# EAGLE design SNAC hdmi-mini (EAGLE 7.7.0)
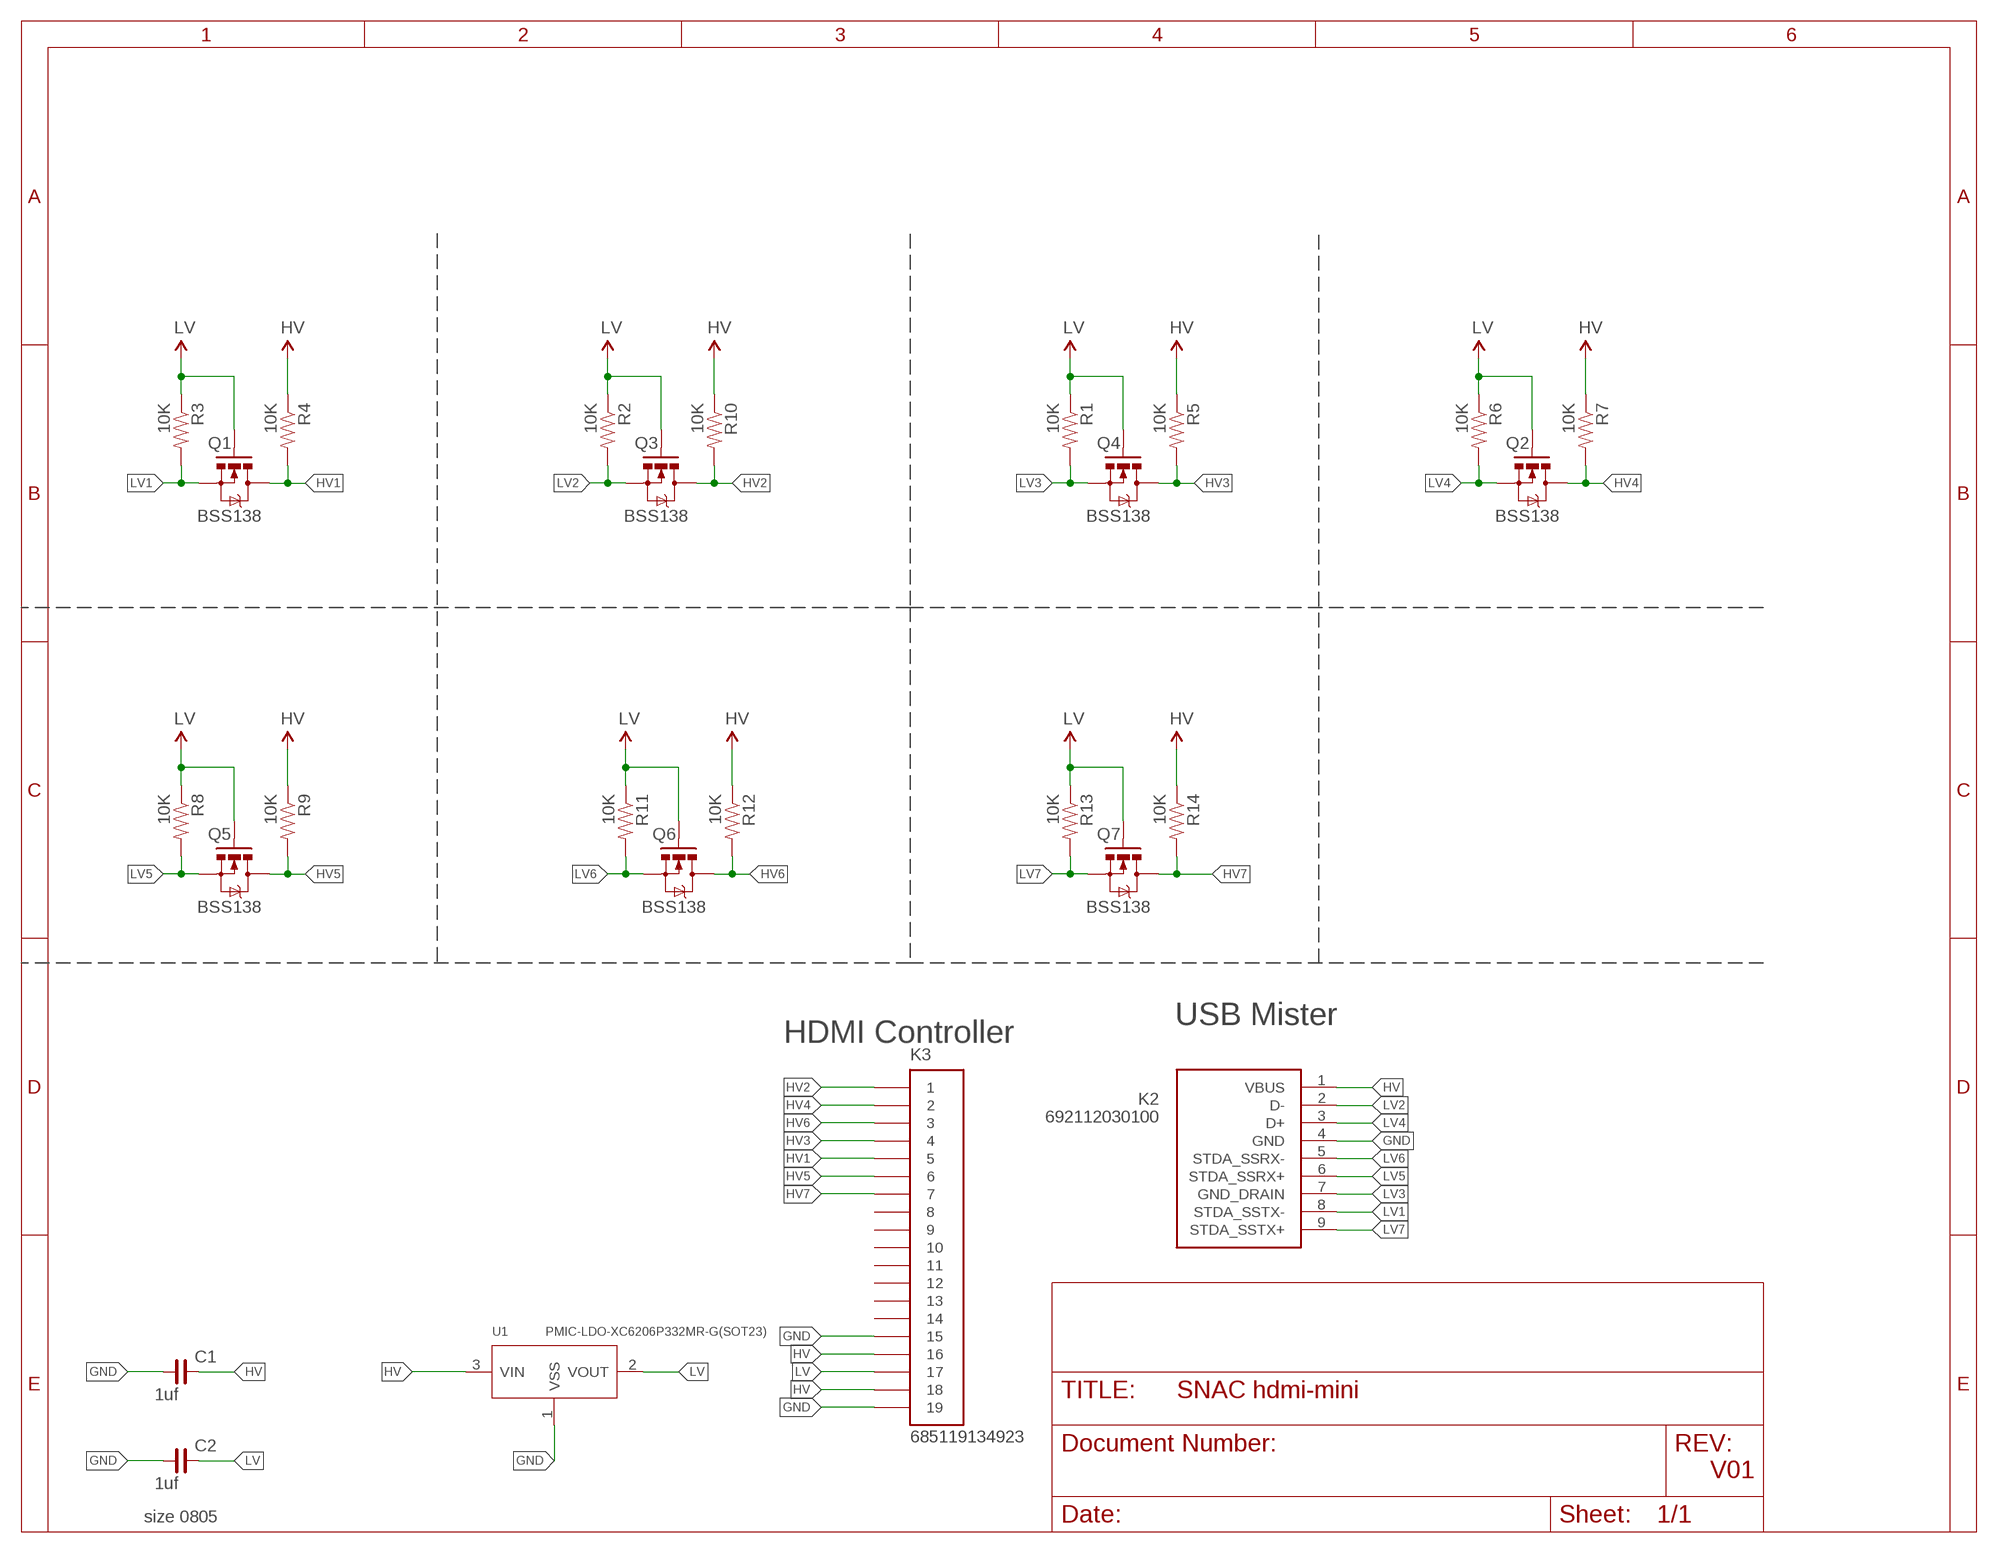
[diagram p0: schematic, sheet 1]

## Parts
C1  1uf  C_0805  [C0805]
C2  1uf  C_0805  [C0805]
K2  692112030100  [692112030100]
K3  685119134923  [685119134923]
Q1  BSS138  MOSFET-NCHANNELSMD  [SOT23-3]
Q2  BSS138  MOSFET-NCHANNELSMD  [SOT23-3]
Q3  BSS138  MOSFET-NCHANNELSMD  [SOT23-3]
Q4  BSS138  MOSFET-NCHANNELSMD  [SOT23-3]
Q5  BSS138  MOSFET-NCHANNELSMD  [SOT23-3]
Q6  BSS138  MOSFET-NCHANNELSMD  [SOT23-3]
Q7  BSS138  MOSFET-NCHANNELSMD  [SOT23-3]
R1  10K  RESISTOR0603-RES  [0603-RES]
R2  10K  RESISTOR0603-RES  [0603-RES]
R3  10K  RESISTOR0603-RES  [0603-RES]
R4  10K  RESISTOR0603-RES  [0603-RES]
R5  10K  RESISTOR0603-RES  [0603-RES]
R6  10K  RESISTOR0603-RES  [0603-RES]
R7  10K  RESISTOR0603-RES  [0603-RES]
R8  10K  RESISTOR0603-RES  [0603-RES]
R9  10K  RESISTOR0603-RES  [0603-RES]
R10  10K  RESISTOR0603-RES  [0603-RES]
R11  10K  RESISTOR0603-RES  [0603-RES]
R12  10K  RESISTOR0603-RES  [0603-RES]
R13  10K  RESISTOR0603-RES  [0603-RES]
R14  10K  RESISTOR0603-RES  [0603-RES]
U1  PMIC-LDO-XC6206P332MR-G(SOT23)  [SOT-23]

## Nets
GND: C1.1 C2.1 K2.4(GND) K3.15 K3.19 U1.1(VSS)
HV: C1.2 K2.1(VBUS) K3.16 K3.18 R4.1 R5.1 R7.1 R9.1 R10.1 R12.1 R14.1 U1.3(VIN)
HV1: K3.5 Q1.3(D) R4.2
HV2: K3.1 Q3.3(D) R10.2
HV3: K3.4 Q4.3(D) R5.2
HV4: K3.2 Q2.3(D) R7.2
HV5: K3.6 Q5.3(D) R9.2
HV6: K3.3 Q6.3(D) R12.2
HV7: K3.7 Q7.3(D) R14.2
LV: C2.2 K3.17 Q1.1(G) Q2.1(G) Q3.1(G) Q4.1(G) Q5.1(G) Q6.1(G) Q7.1(G) R1.1 R2.1 R3.1 R6.1 R8.1 R11.1 R13.1 U1.2(VOUT)
LV1: K2.8(STDA_SSTX-) Q1.2(S) R3.2
LV2: K2.2(D-) Q3.2(S) R2.2
LV3: K2.7(GND_DRAIN) Q4.2(S) R1.2
LV4: K2.3(D+) Q2.2(S) R6.2
LV5: K2.6(STDA_SSRX+) Q5.2(S) R8.2
LV6: K2.5(STDA_SSRX-) Q6.2(S) R11.2
LV7: K2.9(STDA_SSTX+) Q7.2(S) R13.2
Unconnected: K3.8 K3.9 K3.10 K3.11 K3.12 K3.13 K3.14

## Notes on the sheet
- USB Mister
- HDMI Controller
- V01
- size 0805

## Library data of the parts
C1 C2 = rc-master-smd:C_: NON-POLARIZED CAP
K2 = Wuerth_Elektronik_eiCan_Communication_Connectors_STENCIL:692112030100: WR-COM USB 3.0 SMT PLUG WITH CLIPTYPE A
K3 = Wuerth_Elektronik_eiCan_Communication_Connectors_STENCIL:685119134923: WR-COM SMT Horizontal HDMI, 19 pins
Q1-Q7 = SparkFun:MOSFET-NCHANNEL
R1-R14 = SparkFun:RESISTOR: Resistor Basic schematic elements and footprints for 0603, 1206, and PTH resistors.
U1 = PMIC-LDO-XC6206P332MR-G_SOT23_:PMIC-LDO-XC6206P332MR-G(SOT23): 310030099; AVAILABILITY: Unavailable; DESCRIPTION: SMD PMIC; LDO; Vin 6V; 3.3V; 200mA; Without En; 1-Ch; MF: Torex; MP: XC6206P332MR-G; PACKAGE: SOT-23-3 Torex; PRICE: None

## Board
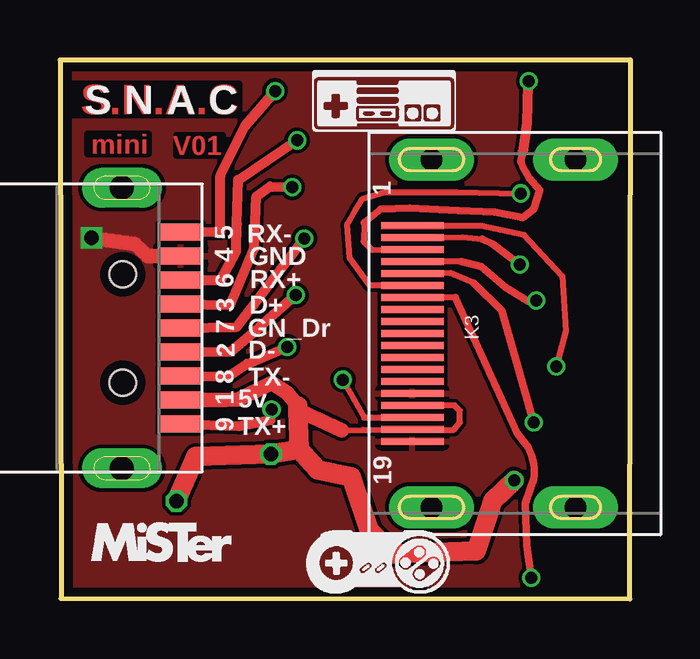
[diagram p1: board, top side]
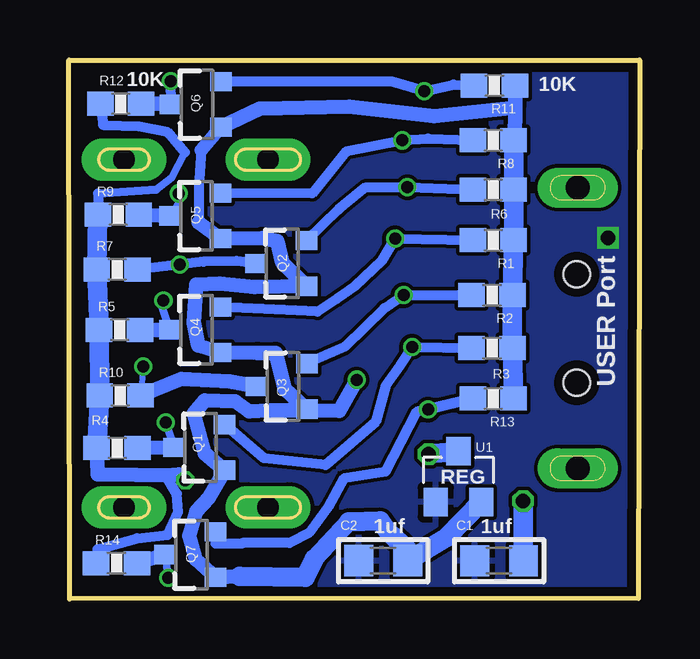
[diagram p2: board, bottom side, seen from below]

Size 23.77 x 22.48 mm. Coordinates in mm from the lower left corner, seen from the top.
Outline: 0.05,0.03 23.75,0 23.77,22.48 0,22.48 0.05,0.03
Copper layers (1*16): Top 0.035559375mm / dielectric 1.6mm / Bottom 0.035559375mm
Design rules "oshpark-2layer": minimum track width 6mil, minimum drill 10mil, track to track 6mil, track to pad 6mil, pad to pad 6mil, via to via 6mil, smd to smd 6mil, copper to edge 15mil, drill to drill 6mil, minimum pad ring 5mil, minimum via ring 5mil, stop-mask expansion 2.5mil, vias tented up to drill 0mil, thermal gap 10mil
Holes 1.1 mm at 2.62,13.54 2.62,9.02

### Footprints (pad centres in the part's own frame; a part is rotated, then mirrored left to right if it is on the bottom)
C0805 = smd 1.2 x 1.3: 1 -1.016,0; 2 1.016,0
692112030100 = smd 0.7 x 1.8: 1 -3,0; 2 -1,0; 3 1,0; 4 3,0; 5 4,0; 6 2,0; 7 0,0; 8 -2,0; 9 -4,0 | drill 1 pad 1.676 long: Z1 5.85,2.45; Z2 -5.85,2.45
685119134923 = smd 0.28 x 2.6: 1 4.5,0; 2 4,0; 3 3.5,0; 4 3,0; 5 2.5,0; 6 2,0; 7 1.5,0; 8 1,0; 9 0.5,0; 10 0,0; 11 -0.5,0; 12 -1,0; 13 -1.5,0; 14 -2,0; 15 -2.5,0; 16 -3,0; 17 -3.5,0; 18 -4,0; 19 -4.5,0 | drill 0.9 pad 1.778 long: Z1 -7.25,-0.8; Z2 -7.25,-6.8; Z3 7.25,-6.8; Z4 7.25,-0.8
SOT23-3 = smd 0.8 x 0.9: 1 -0.95,-1; 2 0.95,-1; 3 0,1.1
0603-RES = smd 1.1 x 1: 1 -0.85,0; 2 0.85,0
SOT-23 = smd 1.016 x 1.2: 1 -0.95,-1.06; 2 0.95,-1.06; 3 0,1.06

### Placement (x,y rotation side)
C1  5.85,1.6 0 bottom
C2  10.68,1.6 0 bottom
K2  5.03,11.3 90 top
K3  14.68,11.07 90 top
Q1  18.29,6.32 90 bottom
Q2  14.88,14 90 bottom
Q3  14.86,8.86 90 bottom
Q4  18.47,11.23 90 bottom
Q5  18.47,15.98 90 bottom
Q6  18.44,20.62 90 bottom
Q7  18.67,1.85 90 bottom
R1  6.1,14.96 180 bottom
R2  6.15,12.67 180 bottom
R3  6.15,10.46 180 bottom
R4  21.77,6.29 0 bottom
R5  21.67,11.23 0 bottom
R6  6.1,17.07 180 bottom
R7  21.77,13.74 0 bottom
R8  6.1,19.13 180 bottom
R9  21.72,16.03 0 bottom
R10  21.64,8.48 0 bottom
R11  6.05,21.41 180 bottom
R12  21.62,20.65 0 bottom
R13  6.1,8.36 180 bottom
R14  21.79,1.5 0 bottom
U1  7.54,5.11 0 bottom

### Tracks (layer width: path | path; a pad name or v marks a point on that pad's centre or on a via)
GND  (via drill 0.6)
  Top 0.61: K2.4 3.66,14.3 3.12,14.81 v1.32,15.06
  pour Top: -0.05,22.53 23.57,22.48 23.77,-0.05 0.05,0.03
  pour Bottom: -0.03,22.45 23.65,22.5 23.77,-0.05 0.03,0.03
HV  (via drill 0.5, 0.6)
  Top 0.254: 12.62,7.06 13.89,7.07 | 13.89,7.07 K3.18 14.75,7.06 16.41,7.06 16.66,7.37 16.66,7.85 16.43,8.08 15.34,8.08 15.34,8.07 K3.16 | 11.74,7.04 13.89,7.07
  Top 0.61: K2.1 6.88,8.31 7.42,8.33 8.81,9.02 9.46,8.59 9.91,8.05 | 11.74,7.04 9.91,7.89
  Top 0.813: 9.91,8.05 9.91,7.89 9.97,6.25 | 9.97,6.25 10.74,5.38 12.13,5.1 12.88,2.87 13.89,1.88 17.35,2.01 17.88,3.63 18.03,4.09 v18.92,4.95 | 9.97,6.25 v8.79,6.05 5.66,5.94 v4.85,4.09
  Bottom 0.305: 18.95,18.62 19.48,17.58 20.14,17.07
  Bottom 0.356: 20.14,17.07 22.56,16.92
  Bottom 0.406: R12.1 22.35,19.76 20.85,19.71 19.69,19.48 18.95,18.62 | 22.56,16.92 R9.1 | R14.1 22.58,2.08 20.93,2.54 19.66,2.67 19.23,3.63 19.28,4.39 19.74,5.16
  Bottom 0.61: R4.1 22.58,5.21 20.98,5.18 19.74,5.16 19.2,5.21 v18.92,4.95
  Bottom 0.813: R5.1 22.54,11.25 | C1.2 v4.85,4.09 | v8.79,6.05 U1.3 | R9.1 R7.1 R5.1 | R5.1 R10.1 R4.1
HV1  (via drill 0.5)
  Top 0.254: 17.25,13.18 16.26,13.59 K3.5
  Top 0.305: v19.74,7.37 19.74,7.34 18.95,10.13 18.42,12.04 17.25,13.18
  Bottom 0.305: Q1.3 v19.74,7.37
  Bottom 0.61: Q1.3 R4.2
HV2  (via drill 0.5)
  Top 0.254: K3.1 17.58,15.57 19.33,15.19 20.93,13.46 21.08,11.18 v20.68,9.7
  Bottom 0.254: v20.68,9.7 R10.2
  Bottom 0.61: Q3.3 17.07,9.07 19.1,9.17 R10.2
HV3  (via drill 0.5)
  Top 0.254: 16.71,14.07 K3.4
  Top 0.305: v19.84,12.45 19.48,12.42 18.57,12.98 17.55,13.87 16.71,14.07
  Bottom 0.305: Q4.3 19.99,12.47 v19.84,12.45
  Bottom 0.61: R5.2 Q4.3
HV4  (via drill 0.5)
  Top 0.254: K3.2 16.76,15.09 17.6,15.01
  Top 0.305: 17.6,15.01 18.03,14.81 v19.15,13.94
  Bottom 0.406: Q2.3 16.79,14.1 18.16,14.07 v19.15,13.94 R7.2
HV5  (via drill 0.5)
  Top 0.254: K3.6 12.9,13.08 12.07,14.22 11.96,15.62 12.32,16.23 12.62,16.69 13.54,16.97 16.54,16.97 v19.2,16.92
  Bottom 0.254: v19.2,16.92 19.15,16.66 Q5.3
  Bottom 0.61: Q5.3 R9.2
HV6  (via drill 0.5)
  Top 0.254: 12.67,15.7 12.65,14.91 13.01,14.55 K3.3
  Top 0.305: 12.67,15.7 13.36,16.26 14.58,16.31 16.59,16.21 18.11,16.13 19.28,15.9 19.74,16.26 19.99,17.04 19.56,17.55 19.3,17.98 19.2,18.24 19.28,18.64
  Top 0.406: v19.53,21.59 19.48,21.46 19.46,19.84 19.28,18.64
  Bottom 0.406: Q6.3 19.51,20.66 v19.53,21.59
  Bottom 0.61: Q6.3 19.57,20.65 R12.2
HV7  (via drill 0.5)
  Top 0.254: 16.46,12.57 K3.7
  Top 0.305: v19.63,0.89 19.46,2.24 19.38,3.99 19.58,4.6 19.74,5 19.76,5.13 19.76,5.44 19.74,5.64 19.66,5.97 19.51,6.32 19.05,6.91 16.46,12.57
  Bottom 0.305: Q7.3 v19.63,0.89
  Bottom 0.61: R14.2 Q7.3
LV  (via drill 0.5)
  Top 0.254: v11.79,9.14 11.76,9.17 12.67,7.57 K3.17
  Bottom 0.406: 18.26,18.72 18.36,17.2 18.36,15.7
  Bottom 0.559: Q6.1 18.26,18.72 | 16.84,8.23 16.26,7.82
  Bottom 0.61: 9.66,2.04 C2.2 | 16.65,0.95 Q7.1 18.49,1.65 18.77,2.64 18.47,3.66 17.96,4.22 Q1.1 18.11,6.07 18.57,7.75 18.11,8.28 16.84,8.23 | R8.1 5.2,19.15 5.18,20.5 | R11.1 5.18,20.5 | 5.18,20.5 8.56,20.14 12.09,20.52 15.82,20.45 Q6.1 | 18.36,15.7 Q5.1 15.72,15.06 15.09,14.94 14.88,14.02 Q2.1 16.03,13 17.5,13.16 18.47,13.11 18.57,11.53 18.39,10.57 Q4.1 15.93,10.26 15.16,10.26 14.78,8.76 Q3.1 15.42,7.87 | 16.26,7.82 15.42,7.87 | 15.42,7.87 12.51,7.85 v11.79,9.14
  Bottom 0.762: 12.12,3.23 13.56,1.68
  Bottom 0.813: R8.1 R6.1 R1.1 R2.1 R3.1 R13.1 | C2.2 8.04,2.57 U1.2 | 9.66,2.04 10.47,2.79 10.8,3.25 12.12,3.23 | 13.56,1.68 13.92,0.91 16.65,0.95
LV1  (via drill 0.5)
  Top 0.406: K2.8 7.01,9.27 7.8,9.8 v9.47,10.52
  Bottom 0.406: R3.2 v9.47,10.52 9.98,9.73 10.57,8.92 11,7.39 13.08,5.59 15.65,5.87 Q1.2
LV2  (via drill 0.5)
  Top 0.406: K2.2 7.11,10.31 8.31,11.33 v9.83,12.67
  Bottom 0.406: R2.2 v9.83,12.67 10.64,12.12 12.29,10.52 Q3.2
LV3  (via drill 0.5)
  Top 0.406: K2.7 7.37,11.35 v10.19,15.04
  Bottom 0.406: R1.2 v10.19,15.04 10.72,14.12 11.84,13.06 12.6,12.52 13.41,11.99 Q4.2
LV4  (via drill 0.5)
  Top 0.406: K2.3 7.09,12.27 8.1,14.63 8.18,16.79 8.74,17.2 v9.68,17.17
  Bottom 0.406: R6.2 v9.68,17.17 11.4,17.17 12.55,16.23 Q2.2
LV5  (via drill 0.5)
  Top 0.406: K2.6 6.64,13.3 6.68,13.26 7.34,14.5 7.37,15.65 7.42,17.48 v9.88,19.13
  Bottom 0.406: R8.2 8.81,19.2 v9.88,19.13 12.22,18.67 13.64,16.92 Q5.2
LV6  (via drill 0.5)
  Top 0.406: K2.5 6.68,15.32 6.68,17.65 7.72,19.74 v8.97,21.18
  Bottom 0.406: R11.2 7.75,21.45 v8.97,21.18 10.33,21.57 Q6.2
LV7  (via drill 0.5)
  Top 0.406: K2.9 7.47,7.21 8.76,7.47 v8.81,7.9
  Bottom 0.406: v8.81,7.9 R13.2 9.3,7.8 10.59,5.31 12.32,5.03 12.98,3.84 13.77,2.77 14.58,2.34 16.56,2.34 16.56,2.31 17.67,2.31 Q7.2

### Text on the board
Top: S.N.A.C | mini | V01
tPlace: S | N | A | C | 1 | 5 | RX- | 4 | GND | 6 | RX+ | 3 | D+ | 7 | GN_Dr | 2 | D- | 8 | TX- | 1 | 5v | 9 | TX+ | 19
bPlace: 10K | 10K | USER Port | REG | 1uf | 1uf
tValues: + | -